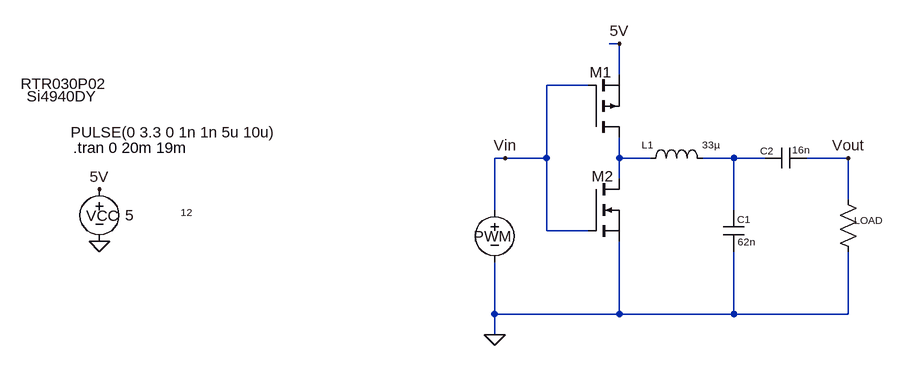
[diagram p0: schematic PWM to Sine (DDS).asc]
PWM to Sine (DDS).asc, the LTspice schematic file:
Version 4
SHEET 1 880 680
WIRE 176 -112 160 -112
WIRE 176 -64 176 -112
WIRE 128 -48 64 -48
WIRE 0 64 -16 64
WIRE 64 64 64 -48
WIRE 64 64 0 64
WIRE 176 64 176 32
WIRE 224 64 176 64
WIRE 352 64 304 64
WIRE 400 64 352 64
WIRE 528 64 464 64
WIRE 176 96 176 64
WIRE 528 128 528 64
WIRE -16 144 -16 64
WIRE 352 144 352 64
WIRE 64 176 64 64
WIRE 128 176 64 176
WIRE -16 304 -16 224
WIRE 176 304 176 192
WIRE 176 304 -16 304
WIRE 352 304 352 208
WIRE 352 304 176 304
WIRE 528 304 528 208
WIRE 528 304 352 304
WIRE -16 336 -16 304
FLAG 176 -112 5V
FLAG 528 64 Vout
FLAG -624 112 5V
FLAG -624 192 0
FLAG 0 64 Vin
FLAG -16 336 0
SYMBOL voltage -16 128 R0
WINDOW 123 0 0 Left 0
WINDOW 39 0 0 Left 0
WINDOW 0 -32 56 Left 2
WINDOW 3 -652 -104 Left 2
SYMATTR InstName PWM
SYMATTR Value PULSE(0 3.3 0 1n 1n 5u 10u)
SYMBOL voltage -624 96 R0
WINDOW 0 -20 57 Left 2
WINDOW 3 40 56 Left 2
WINDOW 123 0 0 Left 0
WINDOW 39 0 0 Left 0
SYMATTR InstName VCC
SYMATTR Value 5
SYMBOL nmos 128 96 R0
WINDOW 3 -864 -127 Left 2
WINDOW 0 2 -164 Left 2
SYMATTR Value Si4940DY
SYMATTR InstName M1
SYMBOL pmos 128 32 M180
WINDOW 3 -873 82 Left 2
WINDOW 0 5 -60 Left 2
SYMATTR Value RTR030P02
SYMATTR InstName M2
SYMBOL ind 208 80 R270
WINDOW 0 26 11 VTop 1
WINDOW 3 47 109 VBottom 1
SYMATTR InstName L1
SYMATTR Value 33µ
SYMATTR SpiceLine Ipk=20 Rser=0
SYMBOL cap 336 144 R0
WINDOW 0 21 14 Left 1
WINDOW 3 22 49 Left 1
SYMATTR InstName C1
SYMATTR Value 62n
SYMBOL cap 464 48 R90
WINDOW 0 15 61 VBottom 1
WINDOW 3 -7 9 VTop 1
SYMATTR InstName C2
SYMATTR Value 16n
SYMATTR SpiceLine Rpar=0
SYMBOL res 512 112 R0
WINDOW 3 -1011 35 Left 1
WINDOW 0 25 48 Left 1
SYMATTR Value 12
SYMATTR InstName LOAD
TEXT -664 48 Left 2 !.tran 0 20m 19m

The netlist it stands for:
* PWM to Sine (DDS).asc
V§PWM Vin 0 PULSE(0 3.3 0 1n 1n 5u 10u)
VCC 5V 0 5
M1 N001 Vin 0 0 Si4940DY
M2 N001 Vin 5V 5V RTR030P02
L1 N001 N002 33µ Ipk=20 Rser=0
C1 N002 0 62n
C2 Vout N002 16n Rpar=0
R§LOAD Vout 0 12
.model NMOS NMOS
.model PMOS PMOS
.lib standard.mos
.tran 0 20m 19m
.backanno
.end